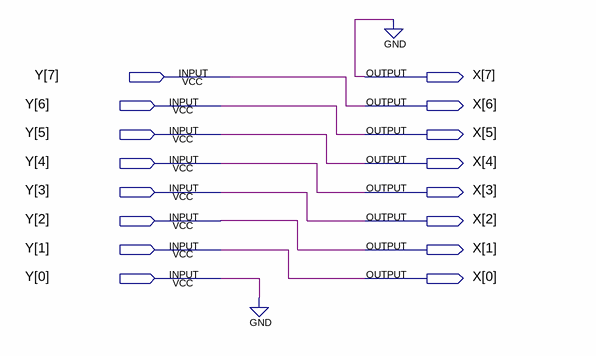
[diagram p0: schematic sheet]
// Quartus schematic CORR1.bdf as structural Verilog: 0 symbols, 16 pins
module CORR1 (
  input  [7:0] Y,
  output [7:0] X
);


  assign X = {1'b0, Y[7:1]};
  // also tied to GND on the sheet: Y[0]
endmodule
